# Altium schematic sheet DS1302.SchDoc
size A4; SheetNumber: 1; SheetTotal: 1
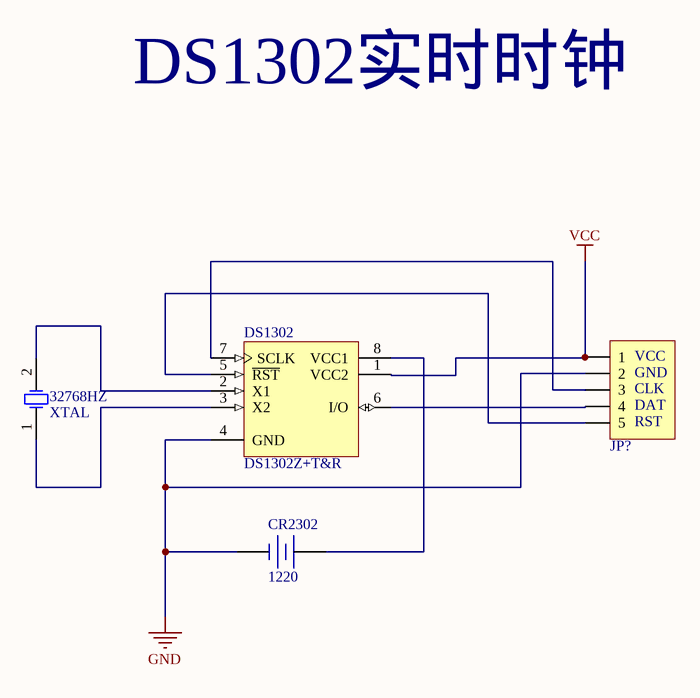
[diagram p0: DS1302.SchDoc]

## Parts
32768HZ  XTAL  [R38]
CR2302  1220  [CR2032_B]
DS1302  DS1302Z+T&R  [DIP8-300_MH]
JP?  HDR-1X5  [HDR-1X5-DS1302]  (value not drawn)

## Nets
GND: CR2302.2(DC-) DS1302.4(GND) JP?.2
VCC: DS1302.1(VCC2) JP?.1
Net32768HZ_1: 32768HZ.1(OSC1) DS1302.3(X2)
Net32768HZ_2: 32768HZ.2(OSC2) DS1302.2(X1)
NetCR2302_1: CR2302.1(DC+) DS1302.8(VCC1)
NetDS1302_5: DS1302.5(~{RST}) JP?.5
NetDS1302_6: DS1302.6(I/O) JP?.4
NetDS1302_7: DS1302.7(SCLK) JP?.3

## Notes on the sheet
- DS1302实时时钟
- (in symbol Header 5_1_DS1302) VCC; GND; CLK; DAT; RST

## Library data of the parts
32768HZ = XTAL: Crystal Oscillator; Published: 8-Jun-2000; LatestRevisionDate: 17-Jul-2002; LatestRevisionNote: Re-released for DXP Platform.; PackageReference: R38; Publisher: Altium Limited; PackageDescription: Crystal, Thru-Hole; 2 Leads; Body 3.1 x 8.2 mm (Dia.xH)
CR2302 = CR-3V: 微型电池; 版权归属: 源创客; BOM名称: 微型电池; 学习资源: www.ooocke.com
DS1302 = DS1302Z+T&R_[C8959]: 实时时钟; ComponentLink1Description: 供应商链接; ComponentLink1URL: http://www.szlcsc.com/product/details_9478.html; Package: SOIC-8_150mil; Supplier: LC; SuppliersPartNumber: C8959
JP? = Header 5_1_DS1302: 5P接插件; 版权归属: 源创客; BOM名称: 5P接插件; 学习资源: www.ooocke.com